# EAGLE design bothsys (EAGLE 7.1.0)
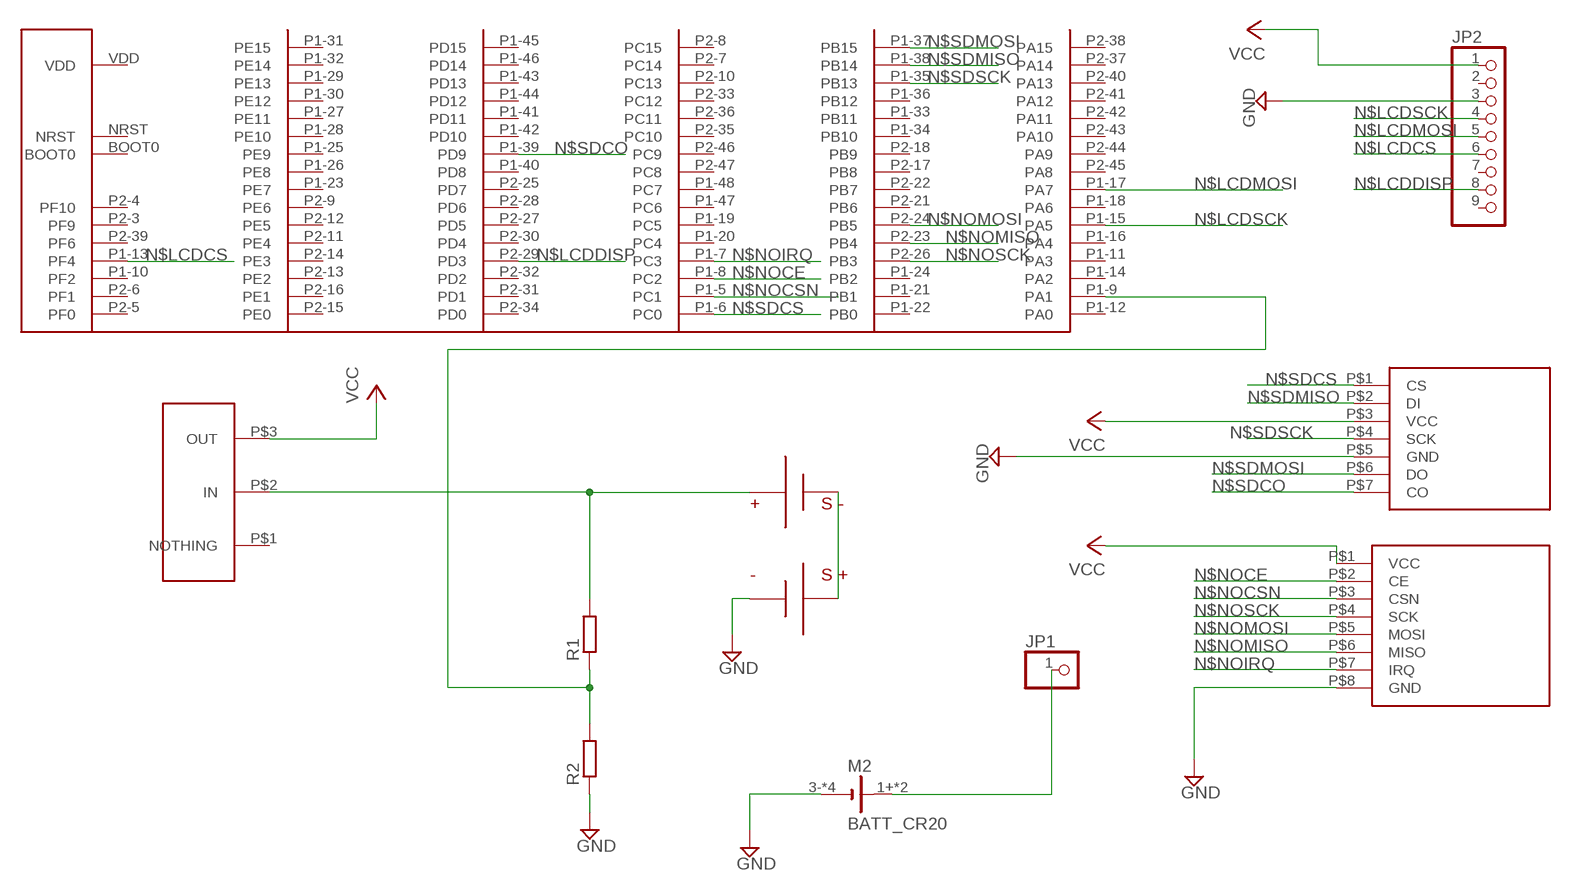
[diagram p0: schematic, sheet 1]

## Parts
JP1  PINHD-1X1  [1X01]
JP2  PINHD-1X9  [1X09]
M2  BATT_CR20  [BATT_CR20]
R1  R-EU_R0805  [R0805]
R2  R-EU_R0805  [R0805]
ST1  STM32_F3  [STM32F3]
U$1  SDCARD  [SDCARD]
U$2  NORDIC_NRF24L01  [NORDIC_NRF24L01]
U$3  OS102011MA1QN1  [OS102011MA1QN1]
U$4  OURBATT  [OURBATT]

## Nets
GND: JP2.3 M2.3-(-) M2.4-(-) M2.5-(-) M2.6-(-) R2.1 U$1.P$5(GND) U$2.P$8(GND) U$4.-(GROUND)
N$1: JP1.1 M2.1+(+) M2.2+(+)
N$2: R1.2 U$3.P$2(IN) U$4.+(POWER)
N$3: U$4.SERIESNEG U$4.SERIESPOS
N$4: R1.1 R2.2 ST1.P1-9(PA1)
N$LCDCS: JP2.6 ST1.P1-13(PF4)
N$LCDDISP: JP2.8 ST1.P2-29(PD3)
N$LCDMOSI: JP2.5 ST1.P1-17(PA7)
N$LCDSCK: JP2.4 ST1.P1-15(PA5)
N$NOCE: ST1.P1-8(PC2) U$2.P$2(CE)
N$NOCSN: ST1.P1-5(PC1) U$2.P$3(CSN)
N$NOIRQ: ST1.P1-7(PC3) U$2.P$7(IRQ)
N$NOMISO: ST1.P2-23(PB4) U$2.P$6(MISO)
N$NOMOSI: ST1.P2-24(PB5) U$2.P$5(MOSI)
N$NOSCK: ST1.P2-26(PB3) U$2.P$4(SCK)
N$SDCO: ST1.P1-39(PD9) U$1.P$7(CO)
N$SDCS: ST1.P1-6(PC0) U$1.P$1(CS)
N$SDMISO: ST1.P1-38(PB14) U$1.P$2(DI)
N$SDMOSI: ST1.P1-37(PB15) U$1.P$6(DO)
N$SDSCK: ST1.P1-35(PB13) U$1.P$4(SCK)
VCC: JP2.1 U$1.P$3(VCC) U$2.P$1(VCC) U$3.P$3(OUT)
Unconnected: JP2.2 JP2.7 JP2.9 ST1.BOOT0 ST1.NRST ST1.P1-10(PF2) ST1.P1-11(PA3) ST1.P1-12(PA0) ST1.P1-14(PA2) ST1.P1-16(PA4) ST1.P1-18(PA6) ST1.P1-19(PC5) ST1.P1-20(PC4) ST1.P1-21(PB1) ST1.P1-22(PB0) ST1.P1-23(PE7) ST1.P1-24(PB2) ST1.P1-25(PE9) ST1.P1-26(PE8) ST1.P1-27(PE11) ST1.P1-28(PE10) ST1.P1-29(PE13) ST1.P1-30(PE12) ST1.P1-31(PE15) ST1.P1-32(PE14) ST1.P1-33(PB11) ST1.P1-34(PB10) ST1.P1-36(PB12) ST1.P1-40(PD8) ST1.P1-41(PD11) ST1.P1-42(PD10) ST1.P1-43(PD13) ST1.P1-44(PD12) ST1.P1-45(PD15) ST1.P1-46(PD14) ST1.P1-47(PC6) ST1.P1-48(PC7) ST1.P2-3(PF9) ST1.P2-4(PF10) ST1.P2-5(PF0) ST1.P2-6(PF1) ST1.P2-7(PC14) ST1.P2-8(PC15) ST1.P2-9(PE6) ST1.P2-10(PC13) ST1.P2-11(PE4) ST1.P2-12(PE5) ST1.P2-13(PE2) ST1.P2-14(PE3) ST1.P2-15(PE0) ST1.P2-16(PE1) ST1.P2-17(PB8) ST1.P2-18(PB9) ST1.P2-21(PB6) ST1.P2-22(PB7) ST1.P2-25(PD7) ST1.P2-27(PD5) ST1.P2-28(PD6) ST1.P2-30(PD4) ST1.P2-31(PD1) ST1.P2-32(PD2) ST1.P2-33(PC12) ST1.P2-34(PD0) ST1.P2-35(PC10) ST1.P2-36(PC11) ST1.P2-37(PA14) ST1.P2-38(PA15) ST1.P2-39(PF6) ST1.P2-40(PA13) ST1.P2-41(PA12) ST1.P2-42(PA11) ST1.P2-43(PA10) ST1.P2-44(PA9) ST1.P2-45(PA8) ST1.P2-46(PC9) ST1.P2-47(PC8) U$3.P$1(NOTHING)

## Power pins joined to a net without a drawn wire
5V: ST1.5V-A(5V) ST1.5V-B(5V)
GND: ST1.GND1(GND) ST1.GND2(GND) ST1.GND3(GND) ST1.GND4(GND) ST1.GND5(GND) ST1.GND6(GND) ST1.GND7(GND) ST1.GND8(GND) ST1.GND9(GND)
VCC: ST1.3V-A(VCC) ST1.3V-B(VCC)
VDD: ST1.VDD

## Library data of the parts
JP1 = pinhead:PINHD-1X1: PIN HEADER
JP2 = pinhead:PINHD-1X9: PIN HEADER
M2 = P442:BATT_CR20
R1 R2 = resistor:R-EU_: RESISTOR, European symbol
ST1 = P442:STM32_F3: STM32 F3 Discovery Board
U$1 = P442:SDCARD
U$2 = P442:NORDIC_NRF24L01
U$3 = ourcomps:OS102011MA1QN1
U$4 = ourcomps:OURBATT

## Board
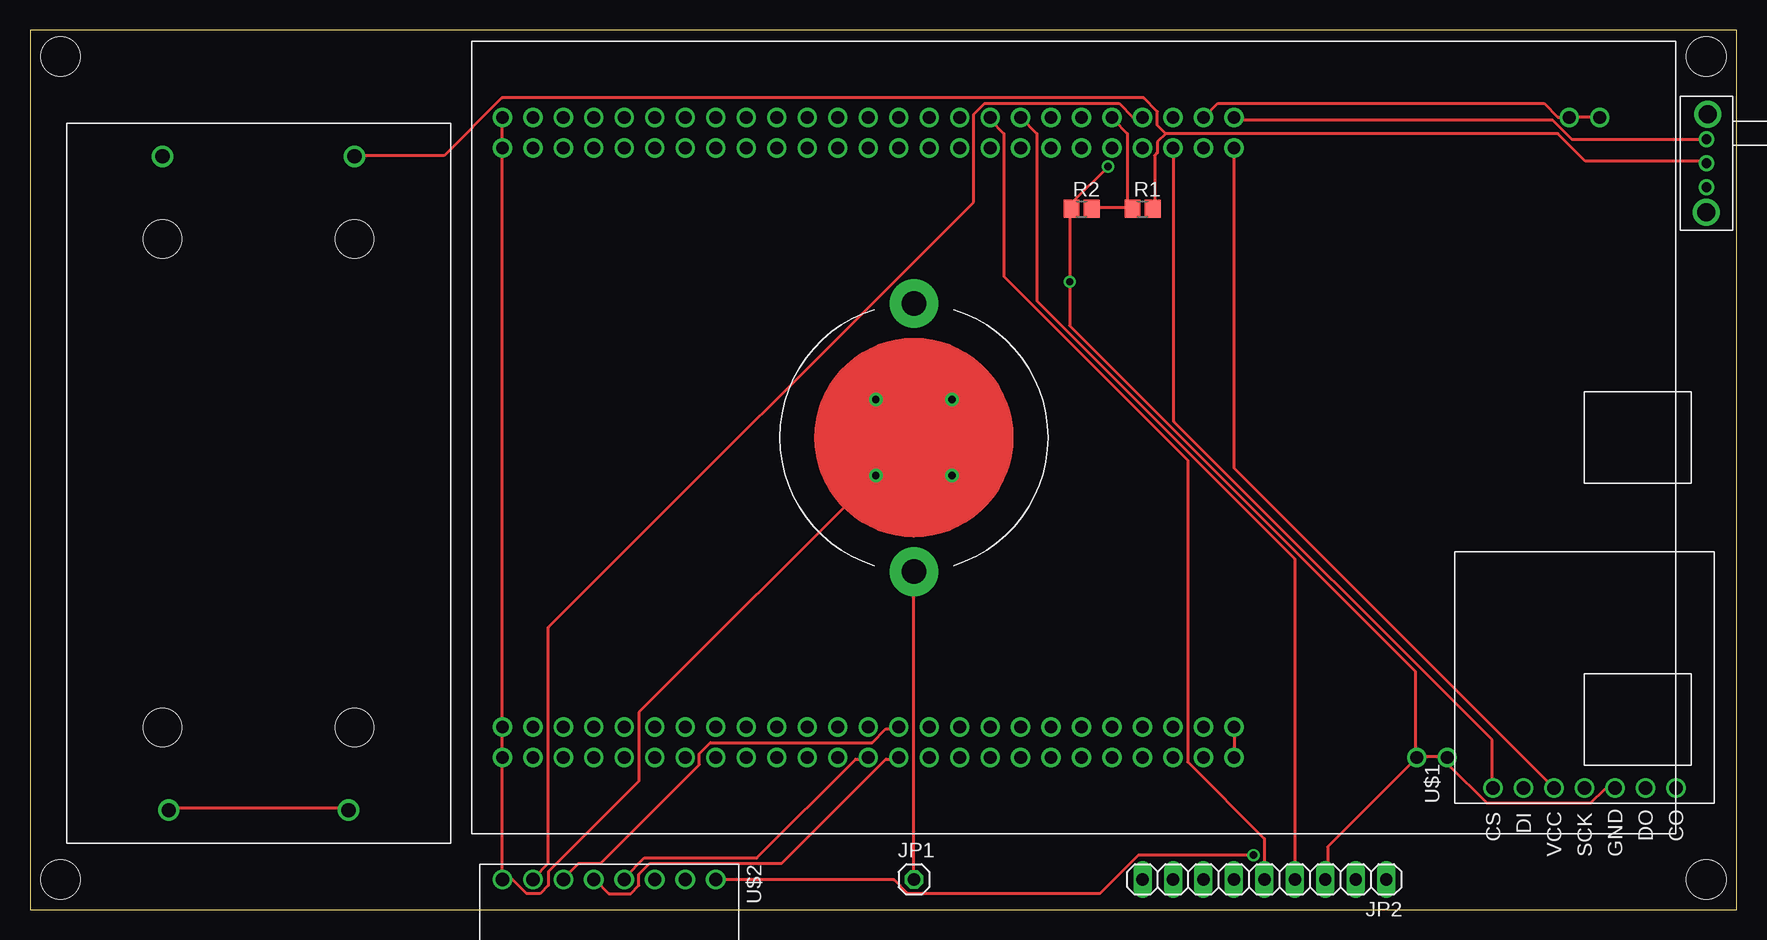
[diagram p1: board, top side]
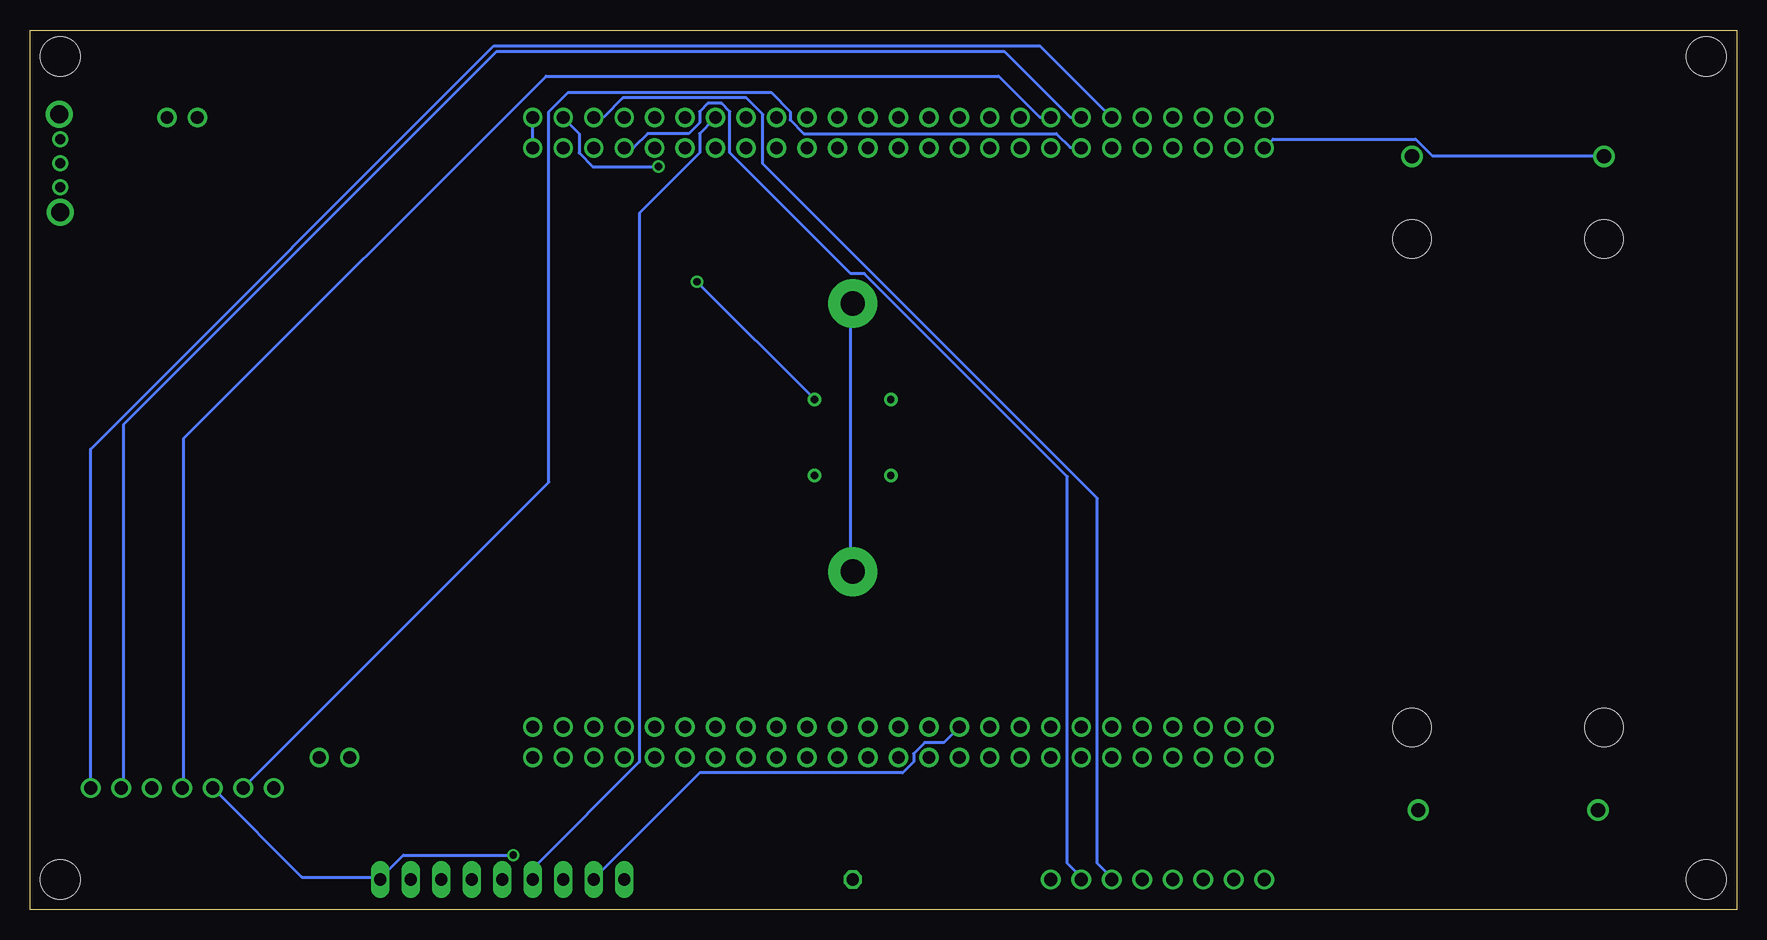
[diagram p2: board, bottom side, seen from below]

Size 142.22 x 73.33 mm. Coordinates in mm from the lower left corner, seen from the top.
Outline: 0,0 142.22,0 142.22,73.33 0,73.33 0,0
Copper layers (1*16): Top 0.035mm / dielectric 1.5mm / Bottom 0.035mm
Design rules "default": minimum track width 10mil, minimum drill 24mil, track to track 8mil, track to pad 8mil, pad to pad 8mil, via to via 8mil, smd to smd 8mil, copper to edge 40mil, drill to drill 8mil, minimum pad ring 10mil, minimum via ring 8mil, stop-mask expansion 4mil, vias tented up to drill 0mil, thermal gap 10mil
Holes 3.3 mm at 2.54,2.54 2.54,71.12 139.7,2.54 139.7,71.12

### Footprints (pad centres in the part's own frame; a part is rotated, then mirrored left to right if it is on the bottom)
1X01 = drill 1.016 octagon: 1 0,0
1X09 = drill 1.016 long: 1 -10.16,0; 2 -7.62,0; 3 -5.08,0; 4 -2.54,0; 5 0,0; 6 2.54,0; 7 5.08,0; 8 7.62,0; 9 10.16,0
BATT_CR20 = drill 2.032 pad 4.064: 1+ -11.176,0; 2+ 11.176,0 | drill 0.61: 3- -3.175,3.175; 4- 3.175,3.175; 5- -3.175,-3.175; 6- 3.175,-3.175
R0805 = smd 1.3 x 1.5: 1 -0.85,0; 2 0.85,0
STM32F3 = drill 1.067: 3V-A -26.67,60.96; 3V-B -24.13,60.96; 5V-A 24.13,60.96; 5V-B 26.67,60.96; BOOT0 24.13,38.1; GND1 -26.67,0; GND2 -24.13,0; GND3 24.13,0; GND4 26.67,0; GND5 -26.67,91.44; GND6 -26.67,88.9; GND7 26.67,78.74; GND8 26.67,76.2; GND9 -26.67,58.42; NRST -24.13,58.42; P1-5 -26.67,55.88; P1-6 -24.13,55.88; P1-7 -26.67,53.34; P1-8 -24.13,53.34; P1-9 -26.67,50.8; P1-10 -24.13,50.8; P1-11 -26.67,48.26; P1-12 -24.13,48.26; P1-13 -26.67,45.72; P1-14 -24.13,45.72; P1-15 -26.67,43.18; P1-16 -24.13,43.18; P1-17 -26.67,40.64; P1-18 -24.13,40.64; P1-19 -26.67,38.1; P1-20 -24.13,38.1; P1-21 -26.67,35.56; P1-22 -24.13,35.56; P1-23 -26.67,33.02; P1-24 -24.13,33.02; P1-25 -26.67,30.48; P1-26 -24.13,30.48; P1-27 -26.67,27.94; P1-28 -24.13,27.94; P1-29 -26.67,25.4; P1-30 -24.13,25.4; P1-31 -26.67,22.86; P1-32 -24.13,22.86; P1-33 -26.67,20.32; P1-34 -24.13,20.32; P1-35 -26.67,17.78; P1-36 -24.13,17.78; P1-37 -26.67,15.24; P1-38 -24.13,15.24; P1-39 -26.67,12.7; P1-40 -24.13,12.7; P1-41 -26.67,10.16; P1-42 -24.13,10.16; P1-43 -26.67,7.62; P1-44 -24.13,7.62; P1-45 -26.67,5.08; P1-46 -24.13,5.08; P1-47 -26.67,2.54; P1-48 -24.13,2.54; P2-3 24.13,58.42; P2-4 26.67,58.42; P2-5 24.13,55.88; P2-6 26.67,55.88; P2-7 24.13,53.34; P2-8 26.67,53.34; P2-9 24.13,50.8; P2-10 26.67,50.8; P2-11 24.13,48.26; P2-12 26.67,48.26; P2-13 24.13,45.72; P2-14 26.67,45.72; P2-15 24.13,43.18; P2-16 26.67,43.18; P2-17 24.13,40.64; P2-18 26.67,40.64; P2-21 24.13,35.56; P2-22 26.67,35.56; P2-23 24.13,33.02; P2-24 26.67,33.02; P2-25 24.13,30.48; P2-26 26.67,30.48; P2-27 24.13,27.94; P2-28 26.67,27.94; P2-29 24.13,25.4; P2-30 26.67,25.4; P2-31 24.13,22.86; P2-32 26.67,22.86; P2-33 24.13,20.32; P2-34 26.67,20.32; P2-35 24.13,17.78; P2-36 26.67,17.78; P2-37 24.13,15.24; P2-38 26.67,15.24; P2-39 24.13,12.7; P2-40 26.67,12.7; P2-41 24.13,10.16; P2-42 26.67,10.16; P2-43 24.13,7.62; P2-44 26.67,7.62; P2-45 24.13,5.08; P2-46 26.67,5.08; P2-47 24.13,2.54; P2-48 26.67,2.54; VDD 26.67,38.1
SDCARD = drill 1.1: P$1 13.97,7.62; P$2 13.97,5.08; P$3 13.97,2.54; P$4 13.97,0; P$5 13.97,-2.54; P$6 13.97,-5.08; P$7 13.97,-7.62
NORDIC_NRF24L01 = drill 1.1: P$1 -5.08,2.54; P$2 -5.08,0; P$3 -5.08,-2.54; P$4 -5.08,-5.08; P$5 -5.08,-7.62; P$6 -5.08,-10.16; P$7 -5.08,-12.7; P$8 -5.08,-15.24
OS102011MA1QN1 = drill 0.8: P$1 -2,0; P$2 0,0; P$3 2,0 | drill 1.5: P$4 -4.1,0; P$5 4.1,-0.1
OURBATT = drill 1.19: + -27.245,8; - -27.245,-8; SERIESNEG 27.245,7.485; SERIESPOS 27.245,-7.485 | hole 3.2: -20.35,8; -20.35,-8; 20.35,-8; 20.35,8

### Placement (x,y rotation side)
JP1  73.66,2.54 0 top
JP2  102.87,2.54 180 top
M2  73.66,39.37 90 top
R1  92.71,58.42 0 top
R2  87.63,58.42 0 top
ST1  39.37,39.37 270 top
U$1  129.54,-3.81 90 top
U$2  54.61,-2.54 270 top
U$3  139.7,62.23 90 top
U$4  19.05,35.56 270 top

### Tracks (layer width: path | path; a pad name or v marks a point on that pad's centre or on a via)
5V
  Top 0.254: ST1.5V-B 100.36,12.8 100.36,15.09 ST1.5V-A
GND  (via drill 0.61)
  Top 0.254: ST1.GND1 39.32,65.84 39.32,63.55 ST1.GND2 39.32,63.32 39.32,15.32 ST1.GND3 39.32,15.09 39.32,12.8 ST1.GND4 39.32,12.57 39.32,2.74 U$2.P$8 39.55,2.52 40.23,2.52 41.38,1.37 42.52,1.37 43.2,2.06 43.2,3.2 50.75,10.74 50.75,16.46 M2.3- | ST1.GND8 108.13,5.26 108.13,2.74 JP2.3 | ST1.GND8 115.67,12.8 117.96,12.8 ST1.GND7 118.19,12.57 118.19,12.12 121.39,8.91 130.07,8.91 131.22,10.06 131.9,10.06 U$1.P$5 | M2.5- 76.81,36.12 70.64,36.12 M2.3- | M2.3- 70.41,36.35 70.41,42.52 M2.4- 70.64,42.52 76.81,42.52 M2.6- | ST1.GND5 130.76,66.06 128.47,66.06 ST1.GND6 128.25,66.06 127.33,66.06 126.19,67.21 98.98,67.21 97.84,66.06 ST1.GND9 | v89.84,61.95 86.87,58.98 86.87,58.52 R2.1 86.64,58.29 v86.64,52.35 86.64,48.69 115.44,19.89 115.44,12.8 ST1.GND8
  Bottom 0.254: ST1.GND2 38.63,64.24 26.75,64.24 25.38,62.87 11.2,62.87 U$4.- | v89.84,61.95 95.33,61.95 96.47,63.09 96.47,64.69 97.61,65.84 ST1.GND9 | v86.64,52.35 M2.6-
N$1
  Top 0.254: JP1.1 73.61,2.74 73.61,28.12 M2.1+
  Bottom 0.254: M2.2+ 73.84,50.52 73.84,28.35 M2.1+
N$2
  Top 0.254: 94.64,64.69 93.95,64.01 93.95,63.09 93.73,62.87 93.73,58.52 R1.2 | 94.64,64.69 127.33,64.69 129.62,62.41 139.68,62.41 U$3.P$2 | 94.64,64.69 93.95,65.38 93.95,66.52 92.81,67.67 39.32,67.67 34.52,62.87 27.2,62.87 U$4.+
N$3
  Top 0.254: U$4.SERIESPOS 11.66,8.46 26.52,8.46 U$4.SERIESNEG
N$4
  Top 0.254: 91.44,58.52 91.67,58.52 R1.1 91.44,58.52 | 91.44,58.52 88.7,58.52 R2.2 | 91.44,58.52 91.44,64.69 90.3,65.84 ST1.P1-9
N$LCDCS
  Bottom 0.254: JP2.6 100.13,2.74 100.13,3.66 91.44,12.34 91.44,58.06 86.41,63.09 86.41,64.69 85.27,65.84 ST1.P1-13
N$LCDDISP
  Bottom 0.254: ST1.P2-29 66.06,13.95 67.67,13.95 68.58,13.03 68.58,12.34 69.49,11.43 86.41,11.43 95.1,2.74 JP2.8
N$LCDMOSI
  Top 0.254: JP2.5 102.87,5.94 96.47,12.34 96.47,37.49 81.15,52.81 81.15,64.69 80.01,65.84 ST1.P1-17
N$LCDSCK
  Top 0.254: ST1.P1-15 83.9,64.69 83.9,50.75 105.39,29.26 105.39,2.74 JP2.4
N$NOCE
  Bottom 0.254: ST1.P1-8 92.58,63.55 91.9,63.55 90.75,64.69 87.33,64.69 86.41,65.61 86.41,66.52 85.72,67.21 84.58,67.21 83.9,66.52 83.9,63.09 73.84,53.03 72.69,53.03 55.78,36.12 55.78,3.89 54.63,2.74 U$2.P$2
N$NOCSN
  Bottom 0.254: ST1.P1-5 95.1,66.06 94.41,66.06 92.81,67.67 82.53,67.67 81.15,66.29 81.15,62.18 53.26,34.29 53.26,3.89 52.12,2.74 U$2.P$3
N$NOIRQ
  Top 0.254: ST1.P1-7 92.58,66.06 91.9,66.06 90.75,67.21 79.55,67.21 78.64,66.29 78.64,58.98 43.2,23.55 43.2,3.89 42.06,2.74 U$2.P$7
N$NOMISO
  Top 0.254: ST1.P2-23 72.24,15.09 71.32,15.09 70.18,13.95 56.69,13.95 55.78,13.03 55.78,12.12 47.55,3.89 45.72,3.89 44.58,2.74 U$2.P$6
N$NOMOSI
  Top 0.254: ST1.P2-24 72.24,12.57 71.32,12.57 62.64,3.89 51.66,3.89 50.75,2.97 50.75,2.06 50.06,1.37 48.23,1.37 47.09,2.52 U$2.P$5
N$NOSCK
  Top 0.254: ST1.P2-26 69.72,12.57 68.81,12.57 60.58,4.34 51.21,4.34 49.61,2.74 U$2.P$4
N$SDCO
  Bottom 0.254: U$1.P$7 137.16,38.41 103.56,72.01 58.06,72.01 52.12,66.06 ST1.P1-39
N$SDCS
  Top 0.254: ST1.P1-6 95.33,63.32 95.33,40.69 121.84,14.17 121.84,10.29 U$1.P$1
N$SDMISO
  Bottom 0.254: ST1.P1-38 54.63,63.55 55.55,63.55 56.69,64.69 77.72,64.69 78.87,65.84 78.87,66.52 80.47,68.12 97.38,68.12 98.98,66.52 98.98,35.66 124.36,10.29 U$1.P$2
N$SDMOSI
  Bottom 0.254: ST1.P1-37 54.63,66.06 55.55,66.06 61.04,71.55 103.33,71.55 134.42,40.46 134.42,10.29 U$1.P$6
N$SDSCK
  Bottom 0.254: ST1.P1-35 57.15,66.06 58.06,66.06 61.49,69.49 99.21,69.49 129.39,39.32 129.39,10.29 U$1.P$4
VCC  (via drill 0.61)
  Top 0.254: ST1.3V-A 100.36,65.84 126.87,65.84 128.47,64.24 139.68,64.24 U$3.P$3 | v101.96,4.57 92.35,4.57 89.15,1.37 73.15,1.37 72.01,2.52 57.15,2.52 U$2.P$1 | U$1.P$3 100.36,36.8 100.36,63.32 ST1.3V-B
  Bottom 0.254: ST1.3V-B 100.36,63.55 100.36,65.84 ST1.3V-A | U$1.P$3 126.87,10.06 119.56,2.74 113.16,2.74 JP2.1 112.93,2.74 111.1,4.57 v101.96,4.57